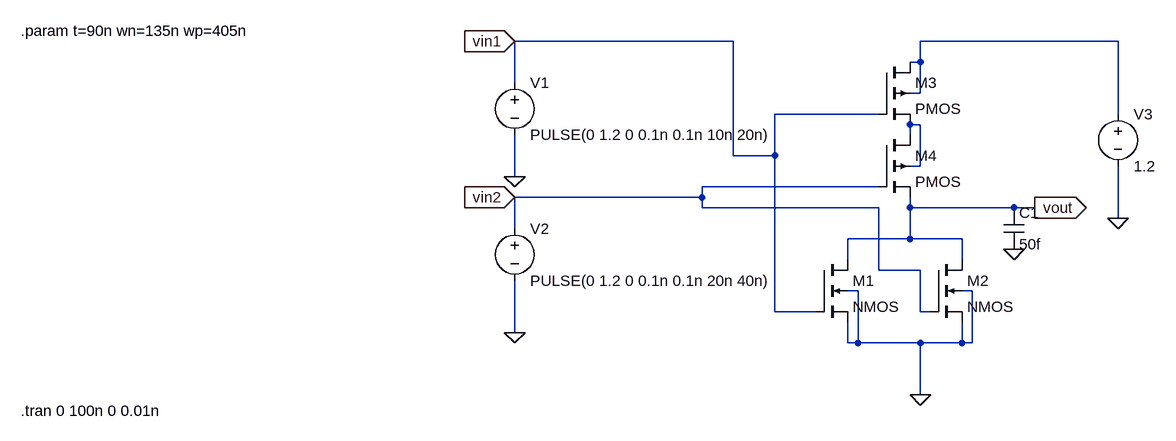
[diagram p0: schematic nor180.asc]
nor180.asc, the LTspice schematic file:
Version 4.1
SHEET 1 880 680
WIRE -48 -272 -384 -272
WIRE 544 -272 240 -272
WIRE 240 -240 240 -272
WIRE 240 -240 224 -240
WIRE -384 -208 -384 -272
WIRE 240 -192 240 -240
WIRE 240 -192 224 -192
WIRE 176 -160 16 -160
WIRE 544 -160 544 -272
WIRE 240 -144 224 -144
WIRE 224 -128 224 -144
WIRE -48 -96 -48 -272
WIRE 16 -96 16 -160
WIRE 16 -96 -48 -96
WIRE 240 -80 240 -144
WIRE 240 -80 224 -80
WIRE -384 -64 -384 -128
WIRE 176 -48 -96 -48
WIRE -96 -32 -96 -48
WIRE -96 -32 -384 -32
WIRE -96 -16 -96 -32
WIRE 176 -16 -96 -16
WIRE 224 -16 224 -32
WIRE 384 -16 224 -16
WIRE 416 -16 384 -16
WIRE 544 0 544 -80
WIRE -384 16 -384 -32
WIRE 224 32 224 -16
WIRE 224 32 128 32
WIRE 304 32 224 32
WIRE 128 64 128 32
WIRE 304 64 304 32
WIRE 176 80 176 -16
WIRE 240 80 176 80
WIRE 144 112 128 112
WIRE 320 112 304 112
WIRE 16 144 16 -96
WIRE 80 144 16 144
WIRE 240 144 240 80
WIRE 256 144 240 144
WIRE -384 176 -384 96
WIRE 128 192 128 160
WIRE 144 192 144 112
WIRE 144 192 128 192
WIRE 240 192 144 192
WIRE 304 192 304 160
WIRE 304 192 240 192
WIRE 320 192 320 112
WIRE 320 192 304 192
WIRE 240 272 240 192
FLAG 240 272 0
FLAG 544 0 0
FLAG -384 -64 0
FLAG -384 176 0
FLAG -384 -272 vin1
IOPIN -384 -272 In
FLAG -384 -32 vin2
IOPIN -384 -32 In
FLAG 416 -16 vout
IOPIN 416 -16 Out
FLAG 384 48 0
SYMBOL nmos4 80 64 R0
SYMATTR InstName M1
SYMATTR Value2 l=t w=wn
SYMBOL nmos4 256 64 R0
SYMATTR InstName M2
SYMATTR Value2 l=t w=wn
SYMBOL pmos4 176 -240 R0
SYMATTR InstName M3
SYMATTR Value2 l=t w=wp
SYMBOL pmos4 176 -128 R0
SYMATTR InstName M4
SYMATTR Value2 l=t w=wp
SYMBOL voltage -384 -224 R0
WINDOW 123 0 0 Left 0
WINDOW 39 0 0 Left 0
SYMATTR InstName V1
SYMATTR Value PULSE(0 1.2 0 0.1n 0.1n 10n 20n)
SYMBOL voltage -384 0 R0
WINDOW 123 0 0 Left 0
WINDOW 39 0 0 Left 0
SYMATTR InstName V2
SYMATTR Value PULSE(0 1.2 0 0.1n 0.1n 20n 40n)
SYMBOL voltage 544 -176 R0
WINDOW 123 0 0 Left 0
WINDOW 39 0 0 Left 0
SYMATTR InstName V3
SYMATTR Value 1.2
SYMBOL cap 368 -16 R0
SYMATTR InstName C1
SYMATTR Value 50f
TEXT -1144 -288 Left 2 !.param t=90n wn=135n wp=405n
TEXT -1144 296 Left 2 !.tran 0 100n 0 0.01n

The netlist it stands for:
* nor180.asc
M1 vout vin1 0 0 NMOS l=t w=wn
M2 vout vin2 0 0 NMOS l=t w=wn
M3 N001 vin1 N002 N001 PMOS l=t w=wp
M4 N002 vin2 vout N002 PMOS l=t w=wp
V1 vin1 0 PULSE(0 1.2 0 0.1n 0.1n 10n 20n)
V2 vin2 0 PULSE(0 1.2 0 0.1n 0.1n 20n 40n)
V3 N001 0 1.2
C1 vout 0 50f
.model NMOS NMOS
.model PMOS PMOS
.lib standard.mos
.param t=90n wn=135n wp=405n
.tran 0 100n 0 0.01n
.backanno
.end